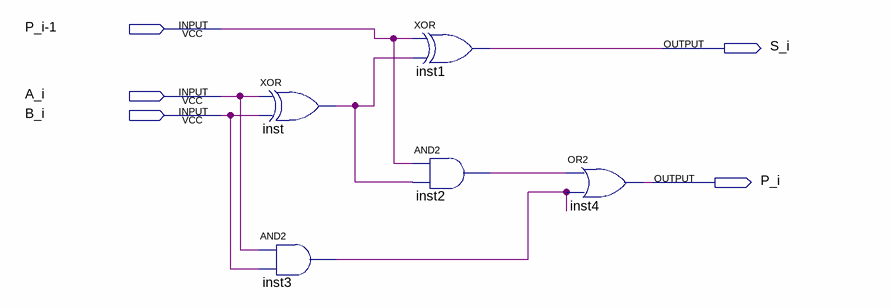
[diagram p0: schematic sheet]
// Quartus schematic 1.bdf as structural Verilog: 5 symbols, 5 pins
module \1  (
  input  \P_i-1 ,
  input  A_i,
  input  B_i,
  output S_i,
  output P_i
);

  wire inst2_out, inst3_out, inst_out;

  xor inst (inst_out, A_i, B_i);
  and inst3 (inst3_out, A_i, B_i);
  xor inst1 (S_i, \P_i-1 , inst_out);
  and inst2 (inst2_out, \P_i-1 , inst_out);
  or inst4 (P_i, inst2_out, inst3_out);
endmodule
